# EAGLE design BPMLabLineRX21 (EAGLE 7.5.0)
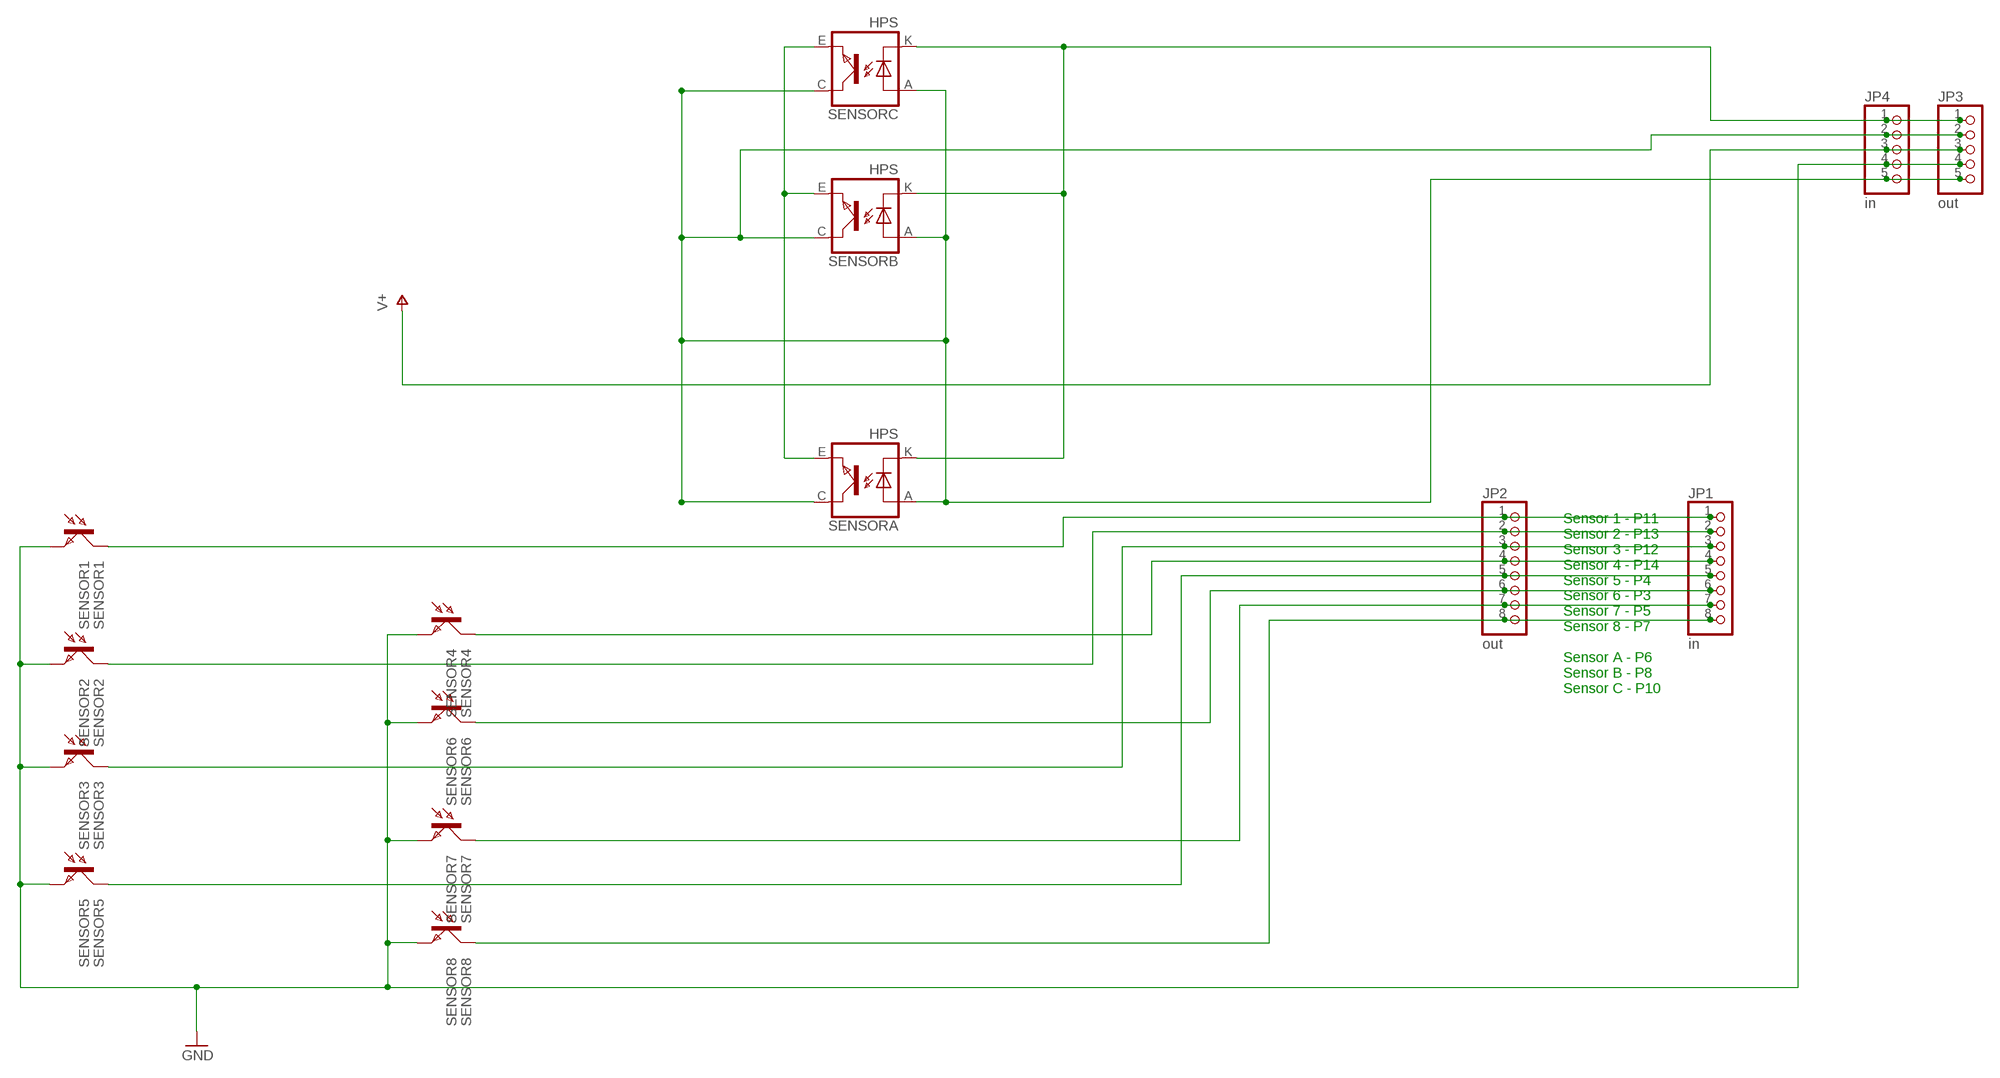
[diagram p0: schematic, sheet 1]

## Parts
JP1  in  PINHD-1X8  [1X08]
JP2  out  PINHD-1X8  [1X08]
JP3  out  PINHD-1X5  [1X05]
JP4  in  PINHD-1X5  [1X05]
SENSOR1  SENSOR1  BPX81  [BPX81]
SENSOR2  SENSOR2  BPX81  [BPX81]
SENSOR3  SENSOR3  BPX81  [BPX81]
SENSOR4  SENSOR4  BPX81  [BPX81]
SENSOR5  SENSOR5  BPX81  [BPX81]
SENSOR6  SENSOR6  BPX81  [BPX81]
SENSOR7  SENSOR7  BPX81  [BPX81]
SENSOR8  SENSOR8  BPX81  [BPX81]
SENSORA  HPS  TCRT5000  [TCRT5000]
SENSORB  HPS  TCRT5000  [TCRT5000]
SENSORC  HPS  TCRT5000  [TCRT5000]

## Nets
GND: JP3.4 JP4.4 SENSOR1.E SENSOR2.E SENSOR3.E SENSOR4.E SENSOR5.E SENSOR6.E SENSOR7.E SENSOR8.E
N$1: JP1.4 JP2.4 SENSOR4.C
N$2: JP1.6 JP2.6 SENSOR6.C
N$3: JP1.7 JP2.7 SENSOR7.C
N$4: JP1.8 JP2.8 SENSOR8.C
N$5: JP1.1 JP2.1 SENSOR1.C
N$6: JP1.2 JP2.2 SENSOR2.C
N$7: JP1.3 JP2.3 SENSOR3.C
N$8: JP1.5 JP2.5 SENSOR5.C
N$10: JP3.1 JP4.1 SENSORA.K(CATHODE) SENSORB.K(CATHODE) SENSORC.K(CATHODE)
N$11: SENSORA.E(EMITTER) SENSORB.E(EMITTER) SENSORC.E(EMITTER)
N$16: JP3.2 JP3.5 JP4.2 JP4.5 SENSORA.A(ANODE) SENSORA.C(COLLECTOR) SENSORB.A(ANODE) SENSORB.C(COLLECTOR) SENSORC.A(ANODE) SENSORC.C(COLLECTOR)
V+: JP3.3 JP4.3

## Notes on the sheet
- Sensor 1 - P11
  Sensor 2 - P13
  Sensor 3 - P12
  Sensor 4 - P14
  Sensor 5 - P4
  Sensor 6 - P3
  Sensor 7 - P5
  Sensor 8 - P7
  
  Sensor A - P6
  Sensor B - P8
  Sensor C - P10

## Library data of the parts
JP1 JP2 = pinhead:PINHD-1X8: PIN HEADER
JP3 JP4 = pinhead:PINHD-1X5: PIN HEADER
SENSOR1-SENSOR8 = opto-trans-siemens:BPX81: PHOTO TRANSISTOR; OC_FARNELL: unknown; OC_NEWARK: unknown
SENSORA SENSORB SENSORC = tcrt5000:TCRT5000

## Board
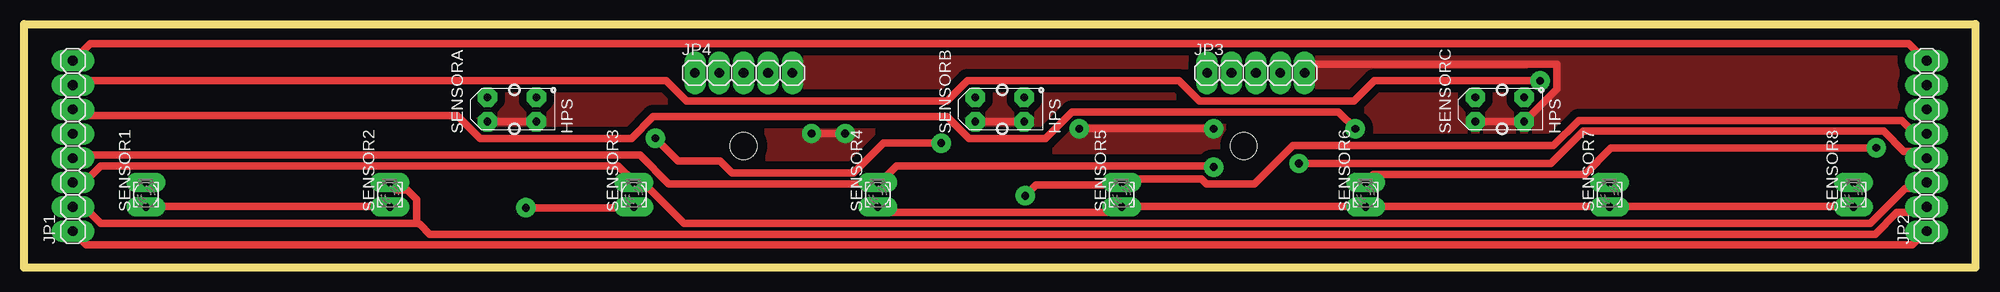
[diagram p1: board, top side]
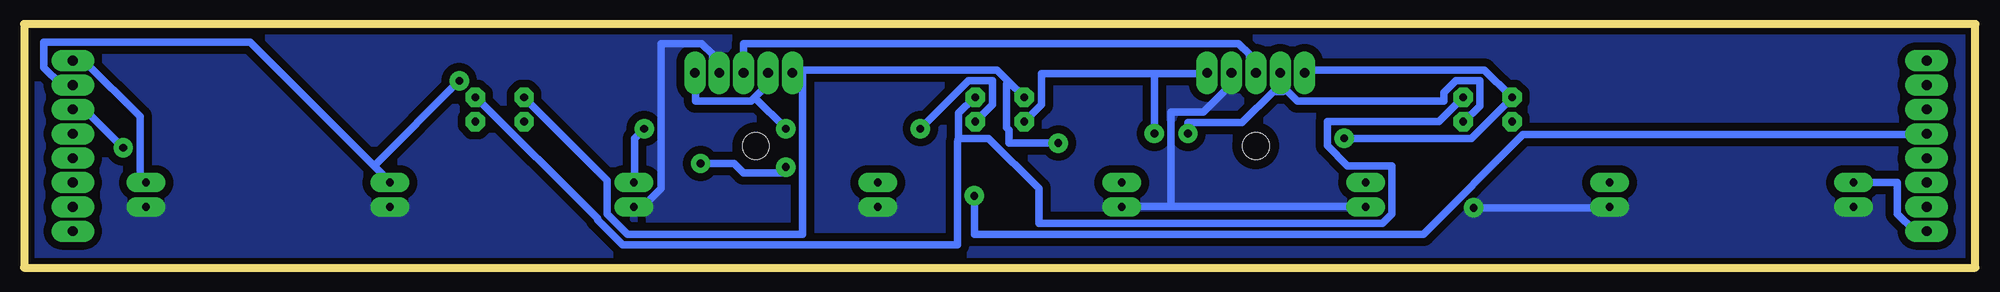
[diagram p2: board, bottom side, seen from below]

Size 203.2 x 25.42 mm. Coordinates in mm from the lower left corner, seen from the top.
Outline: 203.18,0 0,0 0,25.4 203.18,25.42 203.18,0
Outline: 203.18,0 203.2,0
Copper layers (1*16): Top 0.035mm / dielectric 1.5mm / Bottom 0.035mm
Design rules "botpcb": minimum track width 0.8mm, minimum drill 0.8mm, track to track 0.3mm, track to pad 0.3mm, pad to pad 0.3mm, via to via 0.3mm, smd to smd 8mil, copper to edge 40mil, drill to drill 8mil, minimum pad ring 24mil, minimum via ring 24mil, stop-mask expansion 0mil, vias tented up to drill 0mil, thermal gap 0mil
Holes 2.8 mm at 74.93,12.7 127,12.7
Milling: 4 lines

### Footprints (pad centres in the part's own frame; a part is rotated, then mirrored left to right if it is on the bottom)
1X08 = drill 1.016 long: 1 -8.89,0; 2 -6.35,0; 3 -3.81,0; 4 -1.27,0; 5 1.27,0; 6 3.81,0; 7 6.35,0; 8 8.89,0
1X05 = drill 1.016 long: 1 -5.08,0; 2 -2.54,0; 3 0,0; 4 2.54,0; 5 5.08,0
BPX81 = drill 0.813 long: C 1.27,0; E -1.27,0
TCRT5000 = drill 0.8 octagon: A -2.54,-1.27; C 2.54,-1.27; E 2.54,1.27; K -2.54,1.27

### Placement (x,y rotation side)
JP1  5.08,12.7 90 top
JP2  198.12,12.7 90 top
JP3  128.27,20.32 0 top
JP4  74.93,20.32 0 top
SENSOR1  12.7,7.62 90 top
SENSOR2  38.1,7.62 90 top
SENSOR3  63.5,7.62 90 top
SENSOR4  88.9,7.62 90 top
SENSOR5  114.3,7.62 90 top
SENSOR6  139.7,7.62 90 top
SENSOR7  165.1,7.62 90 top
SENSOR8  190.5,7.62 90 top
SENSORA  50.8,16.51 0 top
SENSORB  101.6,16.51 0 top
SENSORC  153.67,16.51 0 top

### Tracks (layer width: path | path; a pad name or v marks a point on that pad's centre or on a via)
GND  (via drill 0.8)
  Top 0.8: SENSOR1.E 12.75,6.38 38,6.38 SENSOR2.E | v52.25,6.25 63.5,6.25 SENSOR3.E | SENSOR8.E 190.5,6.38 165.5,6.38 SENSOR7.E 165,6.38 140.12,6.38 SENSOR6.E 139.62,6.38 114.38,6.38 SENSOR5.E 114,6.12 113.62,5.75 89.5,5.75 SENSOR4.E
  Bottom 0.8: 83.75,6.38 88.88,6.38 SENSOR4.E | 83.75,6.38 63.5,6.38 SENSOR3.E | 83.75,6.38 83.75,16.25 80.38,16.25 78.12,18.5 78.12,19.62 77.5,20.25 JP4.4 | v52.25,6.25 38.12,6.25 SENSOR2.E | JP3.4 130.88,20.38 131.5,21 131.5,22.25 132.62,23.38 136.88,23.38 136.88,8.25 138.75,6.38 139.62,6.38 SENSOR6.E
  pour Bottom (isolate 0.813): 1.27,24.13 201.93,24.13 201.93,1.27 1.27,1.27
N$1  (via drill 0.8)
  Top 0.8: JP1.4 5.12,11.5 5.38,11.75 64.12,11.75 67.12,8.75 88.75,8.75 88.88,8.88 SENSOR4.C 89.25,9 90.88,10.62 123.75,10.62 v123.88,10.5 | v132.75,10.88 159,10.88 162.38,14.25 193.62,14.25 195.75,12.12 197.38,12.12 198,11.5 JP2.4
  Bottom 0.8: v132.75,10.88 129.25,10.88 128.25,9.88 123.88,9.88 v123.88,10.5
N$2  (via drill 0.8)
  Top 0.8: v192.88,12.5 165.25,12.5 162.5,9.75 140.5,9.75 139.75,9 SENSOR6.C | v138.62,14.5 136.88,16.25 109.12,16.25 106.38,13.5 98.38,13.5 96.12,15.75 65.5,15.75 63.25,13.5 47.5,13.5 45.12,15.88 5.75,15.88 5.12,16.5 JP1.6
  Bottom 0.8: v192.88,12.5 196.88,16.5 198,16.5 JP2.6 | v138.62,14.5 139.62,13.5 139.62,9 SENSOR6.C
N$3  (via drill 0.8)
  Top 0.8: v157.88,19.5 140.62,19.5 138.5,17.38 122.38,17.38 120.25,19.5 98.25,19.5 96.12,17.38 69,17.38 66.88,19.5 5.5,19.5 5.12,19.12 JP1.7
  Bottom 0.8: 166.75,10.62 179.62,23.5 201.12,23.5 201.12,20.88 199.38,19.12 198.12,19.12 JP2.7 | 166.75,10.62 165.12,9 SENSOR7.C | 166.75,10.62 v157.88,19.5
N$4
  Top 0.8: JP1.8 5.12,21.62 6.88,23.38 196.25,23.38 198,21.62 JP2.8
  Bottom 0.8: SENSOR8.C 190.5,9 191.12,9.62 191.12,15.75 196.88,21.5 198,21.5 JP2.8
N$5
  Top 0.8: JP2.1 198,3.75 196.62,2.38 6.5,2.38 5.12,3.75 JP1.1
  Bottom 0.8: SENSOR1.C 12.62,8.88 8.12,8.88 8.12,5.62 6.38,3.88 5.12,3.88 JP1.1
N$6
  Top 0.8: 40.88,4.62 40.88,7.12 39.88,8.12 38.88,8.12 38.12,8.88 SENSOR2.C | 40.88,4.62 8,4.62 6.38,6.25 5.12,6.25 JP1.2 | JP2.2 198,6.25 197.5,5.75 195,5.75 192.75,3.5 42.25,3.5 41.25,4.5 40.88,4.62
N$7
  Top 0.8: JP1.3 5.12,9 6.38,9 8,10.62 61.88,10.62 63.5,9 SENSOR3.C 63.88,8.75 64.62,8.75 68.75,4.62 192.25,4.62 195.88,8.25 197.38,8.25 198,8.88 JP2.3
N$8  (via drill 0.8)
  Top 0.8: JP2.5 198,14 196.88,14 195.5,15.38 161.88,15.38 159.25,12.75 132.12,12.75 128.12,8.75 123.12,8.75 122.62,9.25 114.62,9.25 114.38,9 SENSOR5.C 114,8.62 105.38,8.62 v104.25,7.5
  Bottom 0.8: v104.25,7.5 104.25,3.5 57.5,3.5 47.12,13.88 5.12,13.88 JP1.5
N$10  (via drill 0.8)
  Top 0.8: v65.75,13.5 68.12,11.12 72.5,11.12 73.75,9.88 86.38,9.88 89.5,13 v95.5,13
  Bottom 0.8: JP4.1 69.75,20.38 69.75,20.62 51.12,20.62 48.38,17.88 SENSORA.K 48.5,17.5 52.5,13.5 v65.75,13.5 | 100.62,19.38 101.88,20.62 123.12,20.62 123.12,20.38 JP3.1 122.12,20.25 122.12,3.5 140.38,3.5 142.5,5.62 142.5,9.12 151.12,17.75 SENSORC.K | 100.62,19.38 99.12,17.88 SENSORB.K | v95.5,13 100.62,13 100.62,14.38 100.88,14.62 100.88,19.12 100.62,19.38
N$11
  Bottom 0.8: 105.88,13.5 102.75,13.5 97.5,8.25 97.5,4.62 61.75,4.62 60.75,5.62 60.75,10.62 65.38,10.62 67.5,12.75 67.5,15.25 55.88,15.25 53.38,17.75 SENSORA.E | 105.88,13.5 105.88,16.12 104.25,17.75 SENSORB.E | SENSORC.E 156.12,17.75 143.5,5.12 143.5,5 140.88,2.38 106,2.38 106,13.12 105.88,13.5
N$16  (via drill 0.8)
  Top 0.8: SENSORC.A 151.25,15.25 156.12,15.25 SENSORC.C 156.5,15.5 159.62,18.62 159.62,21.25 134.25,21.25 133.38,20.38 JP3.5 | SENSORA.A 48.38,15.25 53.25,15.25 SENSORA.C | SENSORB.A 99.12,15.25 104.12,15.25 SENSORB.C | v85.5,14 v82,14 | v109.88,14.5 v123.88,14.5
  Bottom 0.8: 127.12,17.75 127.5,17.38 133.25,17.38 133.25,20.25 JP3.5 | 127.12,17.75 126.38,18.5 126.38,19.62 125.75,20.25 JP3.2 | SENSORA.C 53.25,15.25 51.62,16.88 51.62,19.5 54.12,19.5 55.38,18.25 55.38,17.38 70.62,17.38 71.75,18.5 71.75,19.62 72.38,20.25 JP4.2 72.12,18.38 73.12,18.38 76.38,15.12 82,15.12 v82,14 | 85.5,20.25 97.25,20.25 97.25,17 99,15.25 SENSORB.A | 85.5,20.25 80.12,20.25 JP4.5 | 85.5,20.25 v85.5,14 | v123.88,14.5 127.12,17.75 | v109.88,14.5 104.88,19.5 102.38,19.5 102.38,17 104.12,15.25 SENSORB.C
  pour Top (isolate 0.813): 1.27,24.13 201.93,24.13 201.93,1.27 1.27,1.27
V+
  Bottom 0.8: JP4.3 75,20.38 75.62,21 75.62,22.25 76.75,23.38 128.25,23.38 128.25,20.38 JP3.3